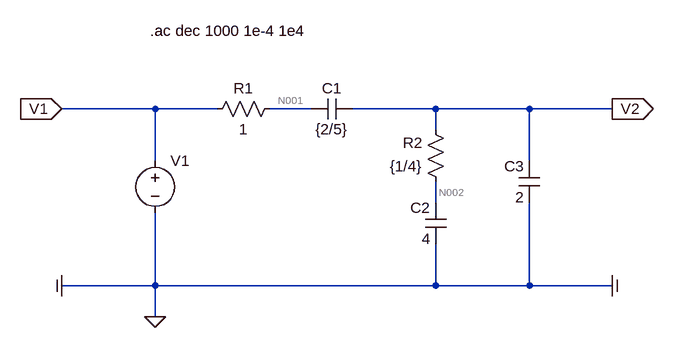
[diagram p0: schematic TS12_Ejercicio_2_LTSpice_Z11.asc]
TS12_Ejercicio_2_LTSpice_Z11.asc, the LTspice schematic file:
Version 4
SHEET 1 880 680
WIRE -384 64 -528 64
WIRE -288 64 -384 64
WIRE -144 64 -208 64
WIRE 48 64 -80 64
WIRE 192 64 48 64
WIRE 320 64 192 64
WIRE 48 96 48 64
WIRE -384 144 -384 64
WIRE 192 144 192 64
WIRE 48 208 48 176
WIRE -384 336 -384 224
WIRE -384 336 -528 336
WIRE 48 336 48 272
WIRE 48 336 -384 336
WIRE 192 336 192 208
WIRE 192 336 48 336
WIRE 320 336 192 336
WIRE -384 384 -384 336
FLAG 320 64 V2
IOPIN 320 64 Out
FLAG -528 64 V1
IOPIN -528 64 In
FLAG -384 384 0
FLAG -528 336 COM
IOPIN -528 336 In
FLAG 320 336 COM
IOPIN 320 336 Out
SYMBOL res -192 48 R90
WINDOW 0 0 56 VBottom 2
WINDOW 3 32 56 VTop 2
SYMATTR InstName R1
SYMATTR Value 1
SYMBOL res 64 192 R180
WINDOW 0 36 76 Left 2
WINDOW 3 36 40 Left 2
SYMATTR InstName R2
SYMATTR Value {1/4}
SYMBOL cap -80 48 R90
WINDOW 0 0 32 VBottom 2
WINDOW 3 32 32 VTop 2
SYMATTR InstName C1
SYMATTR Value {2/5}
SYMBOL cap 64 272 R180
WINDOW 0 24 56 Left 2
WINDOW 3 24 8 Left 2
SYMATTR InstName C2
SYMATTR Value 4
SYMBOL cap 208 208 R180
WINDOW 0 24 56 Left 2
WINDOW 3 24 8 Left 2
SYMATTR InstName C3
SYMATTR Value 2
SYMBOL voltage -384 128 R0
WINDOW 39 0 0 Left 0
SYMATTR InstName V1
SYMATTR Value ""
SYMATTR Value2 AC 1 0
TEXT -392 -56 Left 2 !.ac dec 1000 1e-4 1e4

The netlist it stands for:
* TS12_Ejercicio_2_LTSpice_Z11.asc
R1 N001 V1 1
R2 N002 V2 {1/4}
C1 V2 N001 {2/5}
C2 0 N002 4
C3 0 V2 2
V1 V1 0 AC 1 0
.ac dec 1000 1e-4 1e4
.backanno
.end

* Results of the author's LTspice run, read from the files saved beside the schematic
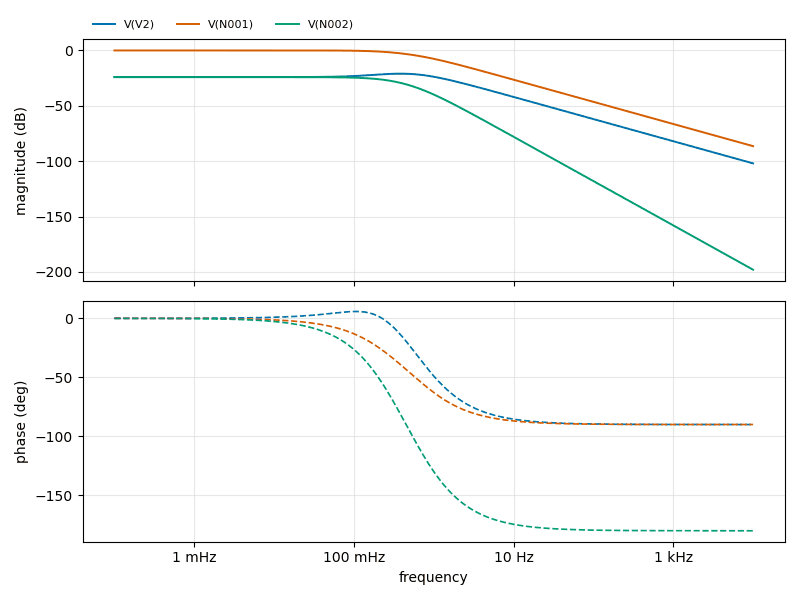
[diagram p1: AC Analysis of TS12_Ejercicio_2_LTSpice_Z11.asc, plotted from the saved traces]
* AC Analysis, 1 run:
*   V(V2): -24.08 dB at 100 µHz, -101.98 dB at 10 kHz, peak -20.99 dB at 380.2 mHz, 3 dB below the peak at 26.28 mHz and 1.041 Hz
*   V(N001): -0.00 dB at 100 µHz, -86.42 dB at 10 kHz, peak -0.00 dB at 100 µHz, 3 dB below the peak at 423 mHz
*   V(N002): -24.08 dB at 100 µHz, -197.95 dB at 10 kHz, peak -24.08 dB at 100 µHz, 3 dB below the peak at 266.6 mHz